# EAGLE schematic untitled (EAGLE 9.1.1)
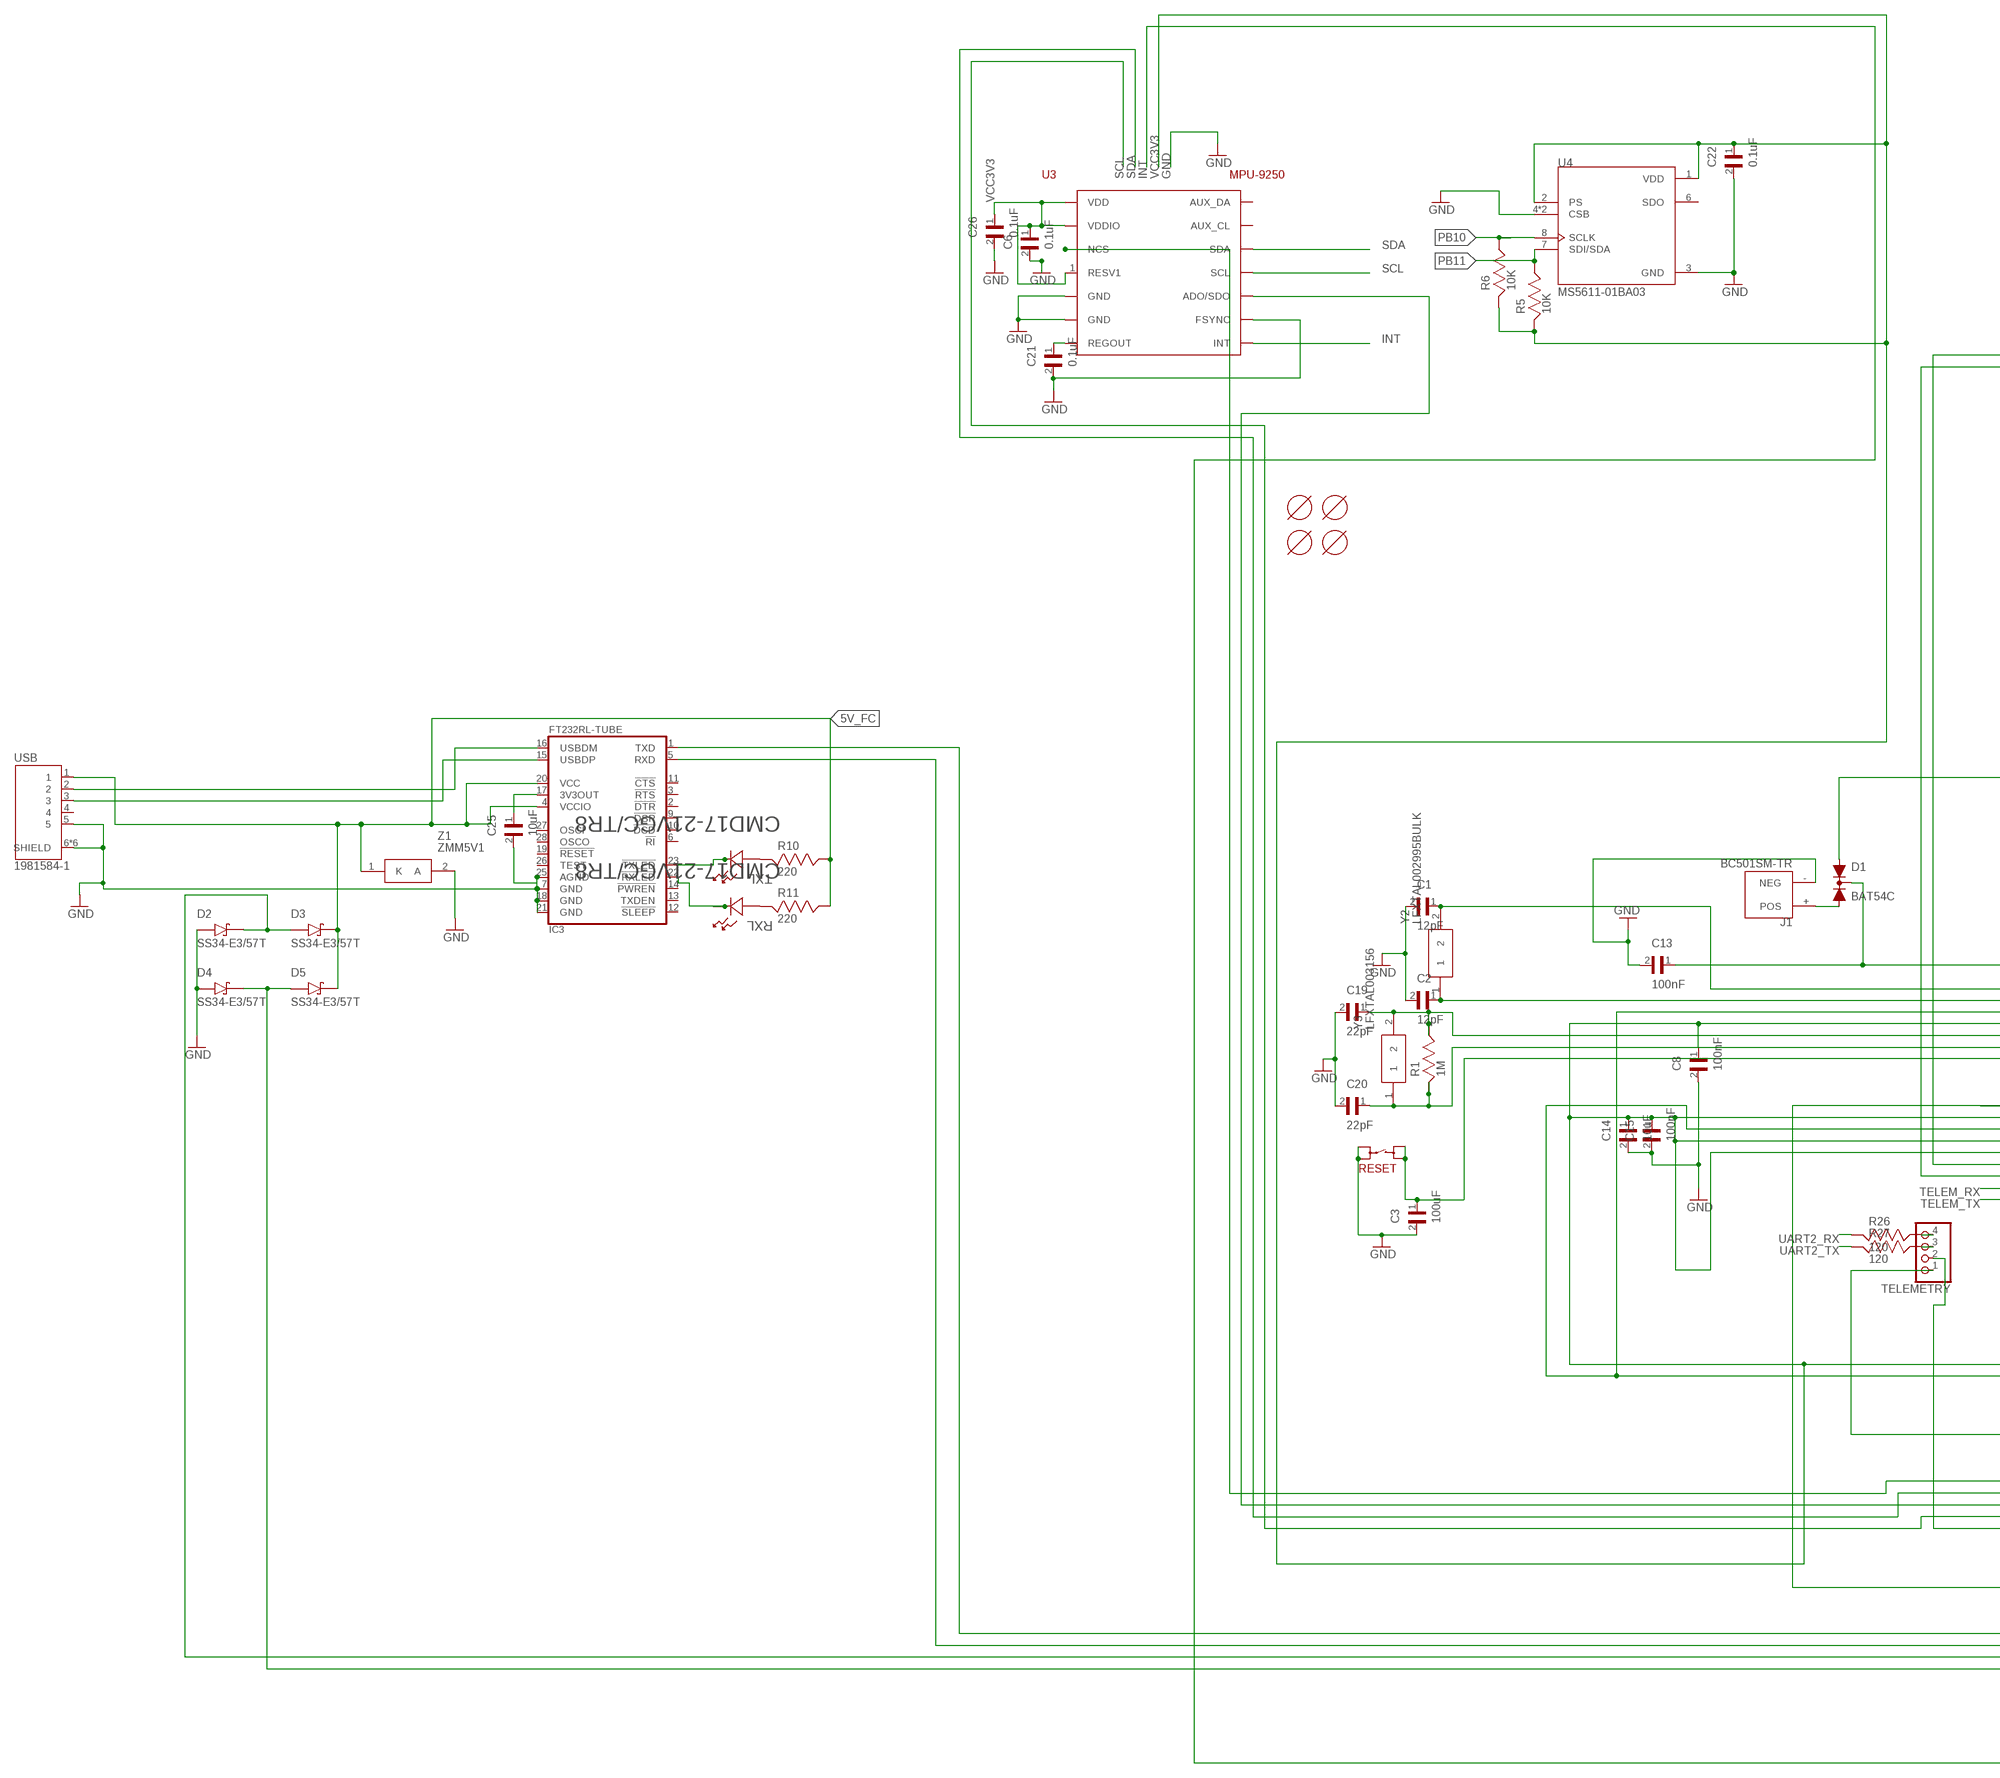
[diagram p0: schematic, sheet 1, part 1 of 2]
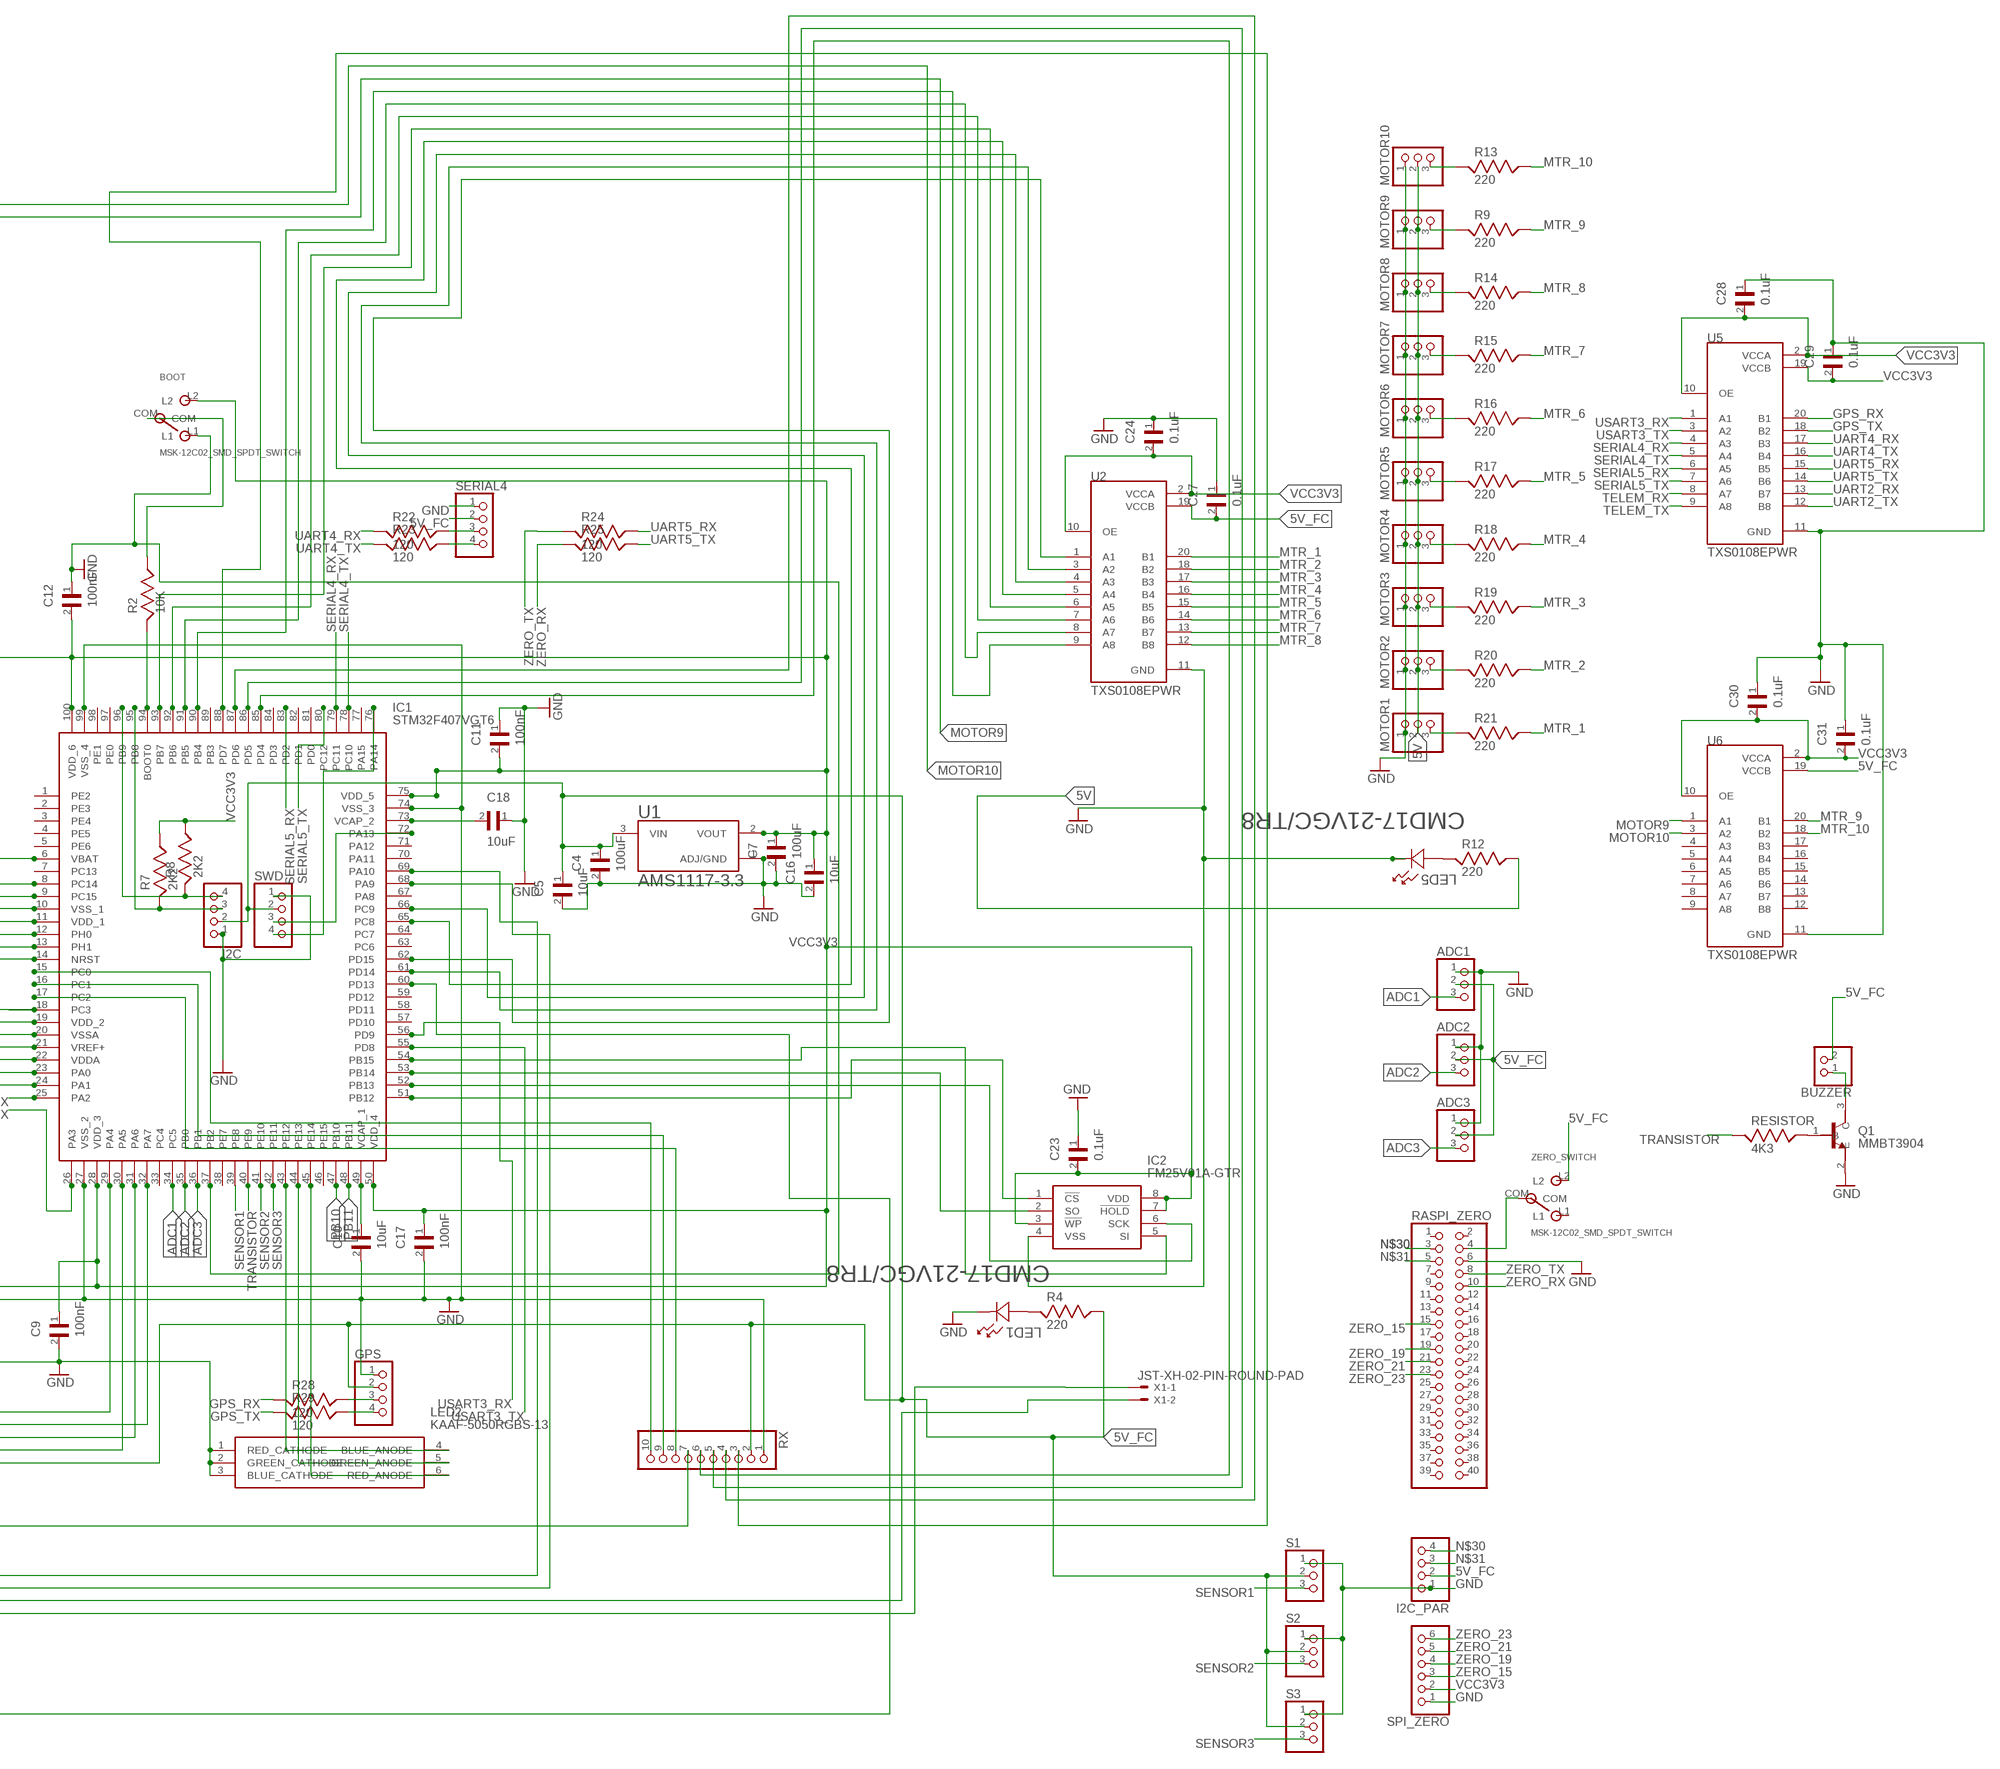
[diagram p1: schematic, sheet 1, part 2 of 2]

## Parts
ADC1  PINHD-1X3  [1X03]
ADC2  PINHD-1X3  [1X03]
ADC3  PINHD-1X3  [1X03]
BOOT  MSK-12C02_SMD_SPDT_SWITCH  [MSK-12C02]
BUZZER  PINHD-1X2  [1X02]
C1  12pF  08053C104KAT4A  [CAPC2012X94N]
C2  12pF  08053C104KAT4A  [CAPC2012X94N]
C3  100uF  08053C104KAT4A  [CAPC2012X94N]
C4  100uF  08053C104KAT4A  [CAPC2012X94N]
C5  10uF  08053C104KAT4A  [CAPC2012X94N]
C6  0.1uF  08053C104KAT4A  [CAPC2012X94N]
C7  100uF  08053C104KAT4A  [CAPC2012X94N]
C8  100nF  08053C104KAT4A  [CAPC2012X94N]
C9  100nF  08053C104KAT4A  [CAPC2012X94N]
C10  10uF  08053C104KAT4A  [CAPC2012X94N]
C11  100nF  08053C104KAT4A  [CAPC2012X94N]
C12  100nF  08053C104KAT4A  [CAPC2012X94N]
C13  100nF  08053C104KAT4A  [CAPC2012X94N]
C14  10uF  08053C104KAT4A  [CAPC2012X94N]
C15  100nF  08053C104KAT4A  [CAPC2012X94N]
C16  10uF  08053C104KAT4A  [CAPC2012X94N]
C17  100nF  08053C104KAT4A  [CAPC2012X94N]
C18  10uF  08053C104KAT4A  [CAPC2012X94N]
C19  22pF  08053C104KAT4A  [CAPC2012X94N]
C20  22pF  08053C104KAT4A  [CAPC2012X94N]
C21  0.1uF  08053C104KAT4A  [CAPC2012X94N]
C22  0.1uF  08053C104KAT4A  [CAPC2012X94N]
C23  0.1uF  08053C104KAT4A  [CAPC2012X94N]
C24  0.1uF  08053C104KAT4A  [CAPC2012X94N]
C25  10uF  08053C104KAT4A  [CAPC2012X94N]
C26  0.1uF  08053C104KAT4A  [CAPC2012X94N]
C27  0.1uF  08053C104KAT4A  [CAPC2012X94N]
C28  0.1uF  08053C104KAT4A  [CAPC2012X94N]
C29  0.1uF  08053C104KAT4A  [CAPC2012X94N]
C30  0.1uF  08053C104KAT4A  [CAPC2012X94N]
C31  0.1uF  08053C104KAT4A  [CAPC2012X94N]
D1  BAT54C  [SOT23-R]
D2  SS34-E3/57T  [DIOM7959X262N]
D3  SS34-E3/57T  [DIOM7959X262N]
D4  SS34-E3/57T  [DIOM7959X262N]
D5  SS34-E3/57T  [DIOM7959X262N]
GPS  PINHD-1X4  [1X04]
I2C  PINHD-1X4  [1X04]
I2C_PAR  PINHD-1X4  [1X04]
IC1  STM32F407VGT6  [QFP50P1600X1600X160-100N]
IC2  FM25V01A-GTR  [SOIC127P602X173-8N]
IC3  FT232RL-TUBE  [SSOP28-LD]
J1  BC501SM-TR  [MPD_BC501SM-TR]
LED1  CMD17-21VGC/TR8  [LED_CMD17-21VGC_TR8]
LED2  KAAF-5050RGBS-13  [KAAF-5050RGBS-13]
LED5  CMD17-21VGC/TR8  [LED_CMD17-21VGC_TR8]
M3_MOUNT1  MOUNT-HOLE3.1MM  [MOUNT-HOLE3.1]
M3_MOUNT1102  MOUNT-HOLE3.1MM  [MOUNT-HOLE3.1]
M3_MOUNT1103  MOUNT-HOLE3.1MM  [MOUNT-HOLE3.1]
M3_MOUNT1104  MOUNT-HOLE3.1MM  [MOUNT-HOLE3.1]
MOTOR1  PINHD-1X3  [1X03]
MOTOR2  PINHD-1X3  [1X03]
MOTOR3  PINHD-1X3  [1X03]
MOTOR4  PINHD-1X3  [1X03]
MOTOR5  PINHD-1X3  [1X03]
MOTOR6  PINHD-1X3  [1X03]
MOTOR7  PINHD-1X3  [1X03]
MOTOR8  PINHD-1X3  [1X03]
MOTOR9  PINHD-1X3  [1X03]
MOTOR10  PINHD-1X3  [1X03]
Q1  MMBT3904  [SOT95P240X120-3N]
R1  1M  RC0805FR-078M2L  [RESC2012X60]
R2  10K  RC0805FR-078M2L  [RESC2012X60]
R4  220  RC0805FR-078M2L  [RESC2012X60]
R5  10K  RC0805FR-078M2L  [RESC2012X60]
R6  10K  RC0805FR-078M2L  [RESC2012X60]
R7  2K2  RC0805FR-078M2L  [RESC2012X60]
R8  2K2  RC0805FR-078M2L  [RESC2012X60]
R9  220  RC0805FR-078M2L  [RESC2012X60]
R10  220  RC0805FR-078M2L  [RESC2012X60]
R11  220  RC0805FR-078M2L  [RESC2012X60]
R12  220  RC0805FR-078M2L  [RESC2012X60]
R13  220  RC0805FR-078M2L  [RESC2012X60]
R14  220  RC0805FR-078M2L  [RESC2012X60]
R15  220  RC0805FR-078M2L  [RESC2012X60]
R16  220  RC0805FR-078M2L  [RESC2012X60]
R17  220  RC0805FR-078M2L  [RESC2012X60]
R18  220  RC0805FR-078M2L  [RESC2012X60]
R19  220  RC0805FR-078M2L  [RESC2012X60]
R20  220  RC0805FR-078M2L  [RESC2012X60]
R21  220  RC0805FR-078M2L  [RESC2012X60]
R22  120  RC0805FR-078M2L  [RESC2012X60]
R23  120  RC0805FR-078M2L  [RESC2012X60]
R24  120  RC0805FR-078M2L  [RESC2012X60]
R25  120  RC0805FR-078M2L  [RESC2012X60]
R26  120  RC0805FR-078M2L  [RESC2012X60]
R27  120  RC0805FR-078M2L  [RESC2012X60]
R28  120  RC0805FR-078M2L  [RESC2012X60]
R29  120  RC0805FR-078M2L  [RESC2012X60]
RASPI_ZERO  PINHD-2X20  [2X20]
RESET  SKRPABE010  [SKRPABE010]
RESISTOR  4K3  RC0805FR-078M2L  [RESC2012X60]
RX  PINHD-1X10  [1X10]
RXL  CMD17-21VGC/TR8  [LED_CMD17-21VGC_TR8]
S1  PINHD-1X3  [1X03]
S2  PINHD-1X3  [1X03]
S3  PINHD-1X3  [1X03]
SERIAL4  PINHD-1X4  [1X04]
SPI_ZERO  PINHD-1X6  [1X06]
SWD  PINHD-1X4  [1X04]
TELEMETRY  PINHD-1X4  [1X04]
TXL  CMD17-21VGC/TR8  [LED_CMD17-21VGC_TR8]
U1  AMS1117-3.3  [SOT229P700X180-4N]
U2  TXS0108EPWR  [SOP65P640X120-20N]
U3  MPU-9250  [MPU-9250]
U4  MS5611-01BA03  [SON125P500X300X100-8N]
U5  TXS0108EPWR  [SOP65P640X120-20N]
U6  TXS0108EPWR  [SOP65P640X120-20N]
USB  1981584-1  [TE_1981584-1]
X1  JST-XH-02-PIN-ROUND-PAD  [JST-XH-02-PACKAGE-ROUND-PAD]
Y2  LFXTAL002995BULK  [LFXTAL002995BULK]
Y3  LFXTAL003156  [IQD-HC-49-4H]
Z1  ZMM5V1  [ZMM5V1]
ZERO_SWITCH  MSK-12C02_SMD_SPDT_SWITCH  [MSK-12C02]

## Nets
5V: MOTOR1.2 MOTOR2.2 MOTOR3.2 MOTOR4.2 MOTOR5.2 MOTOR6.2 MOTOR7.2 MOTOR8.2 MOTOR9.2 MOTOR10.2 R12.2
5V_FC: ADC1.2 ADC2.2 ADC3.2 BUZZER.2 C4.1 C5.1 C27.2 D3.C D5.C GPS.2 I2C.2 I2C_PAR.2 IC3.4(VCCIO) IC3.20(VCC) R4.2 R10.2 R11.2 RX.2 S1.2 S2.2 S3.2 SERIAL4.2 SWD.2 TELEMETRY.2 U1.3(VIN) U2.19(VCCB) U6.19(VCCB) USB.1 Z1.1(K) ZERO_SWITCH.L2
ADC1: ADC1.3 IC1.34(PC5)
ADC2: ADC2.3 IC1.35(PB0)
ADC3: ADC3.3 IC1.36(PB1)
GND: ADC1.1 ADC2.1 ADC3.1 BOOT.L1 C1.2 C2.2 C3.2 C4.2 C5.2 C6.2 C7.2 C8.2 C9.2 C10.2 C11.1 C12.1 C13.2 C14.2 C15.2 C16.2 C17.2 C18.1 C19.2 C20.2 C21.2 C22.2 C23.1 C24.1 C25.2 C26.2 C27.1 C28.1 C29.1 C30.1 C31.1 D2.A D4.A GPS.1 I2C.1 I2C_PAR.1 IC1.10(VSS_1) IC1.20(VSSA) IC1.27(VSS_2) IC1.37(PB2) IC1.74(VSS_3) IC1.99(VSS_4) IC2.4(VSS) IC3.7(GND) IC3.18(GND) IC3.21(GND) IC3.25(AGND) J1.-(NEG) LED1.2 LED2.1(RED_CATHODE) LED2.2(GREEN_CATHODE) LED2.3(BLUE_CATHODE) LED5.2 MOTOR1.1 MOTOR2.1 MOTOR3.1 MOTOR4.1 MOTOR5.1 MOTOR6.1 MOTOR7.1 MOTOR8.1 MOTOR9.1 MOTOR10.1 Q1.2(E) RASPI_ZERO.6 RESET.P$1 RESET.P$2 RX.1 S1.1 S2.1 S3.1 SERIAL4.1 SPI_ZERO.1 SWD.1 TELEMETRY.1 U1.1(ADJ/GND) U2.11(GND) U3.11(FSYNC) U3.18(GND) U3.20(GND) U4.3(GND) U4.4(CSB) U4.5(CSB) U5.11(GND) U6.11(GND) USB.5 USB.6(SHIELD) USB.7(SHIELD) USB.8(SHIELD) USB.9(SHIELD) USB.10(SHIELD) USB.11(SHIELD) Z1.2(A)
GND1: IC3.23(!TXLED) TXL.2
GND2: IC3.22(!RXLED) RXL.2
GPS_RX: R28.1 U5.20(B1)
GPS_TX: R29.1 U5.18(B2)
INT: IC1.60(PD13) U3.12(INT)
MOTOR9: IC1.24(PA1) U6.1(A1)
MOTOR10: IC1.23(PA0) U6.3(A2)
MTR_1: R21.2 U2.20(B1)
MTR_2: R20.2 U2.18(B2)
MTR_3: R19.2 U2.17(B3)
MTR_4: R18.2 U2.16(B4)
MTR_5: R17.2 U2.15(B5)
MTR_6: R16.2 U2.14(B6)
MTR_7: R15.2 U2.13(B7)
MTR_8: R14.2 U2.12(B8)
MTR_9: R9.2 U6.20(B1)
MTR_10: R13.2 U6.18(B2)
N$1: Q1.1(B) RESISTOR.2
N$2: IC1.72(PA13) SWD.3
N$3: C18.2 IC1.73(VCAP_2)
N$4: IC1.76(PA14) SWD.4
N$5: MOTOR10.3 R13.1
N$6: C3.1 IC1.14(NRST) RESET.P$3 RESET.P$4
N$7: IC1.69(PA10) IC3.1(TXD)
N$8: IC1.68(PA9) IC3.5(RXD)
N$9: IC1.94(BOOT0) R2.1
N$10: C21.1 U3.10(REGOUT)
N$11: BOOT.COM R2.2
N$12: BUZZER.1 Q1.3(C)
N$13: LED1.1 R4.1
N$14: IC1.62(PD15) U2.1(A1)
N$15: IC3.16(USBDM) USB.2
N$16: IC1.90(PB4) U2.9(A8)
N$17: IC3.15(USBDP) USB.3
N$18: IC1.92(PB6) U2.7(A6)
N$19: IC1.93(PB7) U2.6(A5)
N$20: MOTOR9.3 R9.1
N$21: IC1.65(PC8) U2.5(A4)
N$22: IC1.54(PB15) IC2.5(SI)
N$23: IC1.53(PB14) IC2.2(SO)
N$24: IC1.52(PB13) IC2.6(SCK)
N$25: IC1.51(PB12) IC2.1(!CS)
N$26: IC1.66(PC9) U2.4(A3)
N$27: IC1.61(PD14) U2.3(A2)
N$28: LED5.1 R12.1
N$29: IC1.45(PE14) LED2.6(RED_ANODE)
N$30: I2C.4 I2C_PAR.4 IC1.96(PB9) R8.1 RASPI_ZERO.3
N$31: I2C.3 I2C_PAR.3 IC1.95(PB8) R7.1 RASPI_ZERO.5
N$32: R26.2 TELEMETRY.4
N$33: C25.1 IC3.17(3V3OUT)
N$34: R10.1 TXL.1
N$35: IC1.91(PB5) U2.8(A7)
N$36: R11.1 RXL.1
N$37: IC1.44(PE13) LED2.5(GREEN_ANODE)
N$38: IC1.43(PE12) LED2.4(BLUE_ANODE)
N$39: IC1.85(PD4) RX.6
N$40: IC1.86(PD5) RX.5
N$41: IC1.87(PD6) RX.4
N$42: IC1.88(PD7) RX.3
N$43: C13.1 D1.3(C) IC1.6(VBAT)
N$44: R27.2 TELEMETRY.3
N$45: GPS.3 R28.2
N$46: GPS.4 R29.2
N$47: D1.2(A2) J1.+(POS)
N$48: RASPI_ZERO.4 ZERO_SWITCH.COM
N$49: D4.C D5.A X1.1
N$50: D2.C D3.A X1.2
N$52: MOTOR1.3 R21.1
N$53: MOTOR8.3 R14.1
N$54: MOTOR7.3 R15.1
N$55: MOTOR6.3 R16.1
N$56: MOTOR5.3 R17.1
N$57: MOTOR4.3 R18.1
N$58: IC1.18(PC3) RX.7
N$59: IC1.17(PC2) RX.8
N$60: IC1.16(PC1) RX.9
N$61: IC1.15(PC0) RX.10
N$62: MOTOR3.3 R19.1
N$63: C1.1 IC1.8(PC14) Y2.2
N$64: C2.1 IC1.9(PC15) Y2.1
N$65: MOTOR2.3 R20.1
N$76: C20.1 IC1.13(PH1) R1.1 Y3.1
N$77: C10.1 IC1.49(VCAP_1)
N$97: IC1.29(PA4) U3.22(NCS)
N$101: C19.1 IC1.12(PH0) R1.2 Y3.2
PB10: IC1.47(PB10) R6.2 U4.8(SCLK)
PB11: IC1.48(PB11) R5.2 U4.7(SDI/SDA)
PC10_TX: R23.2 SERIAL4.4
PC11_RX: R22.2 SERIAL4.3
SCL: IC1.30(PA5) U3.23(SCL)
SDA: IC1.32(PA7) U3.24(SDA)
SDO: IC1.31(PA6) U3.9(ADO/SDO)
SENSOR1: IC1.39(PE8) S1.3
SENSOR2: IC1.41(PE10) S2.3
SENSOR3: IC1.42(PE11) S3.3
SERIAL4_RX: IC1.79(PC11) U5.4(A3)
SERIAL4_TX: IC1.78(PC10) U5.5(A4)
SERIAL5_RX: IC1.83(PD2) U5.6(A5)
SERIAL5_TX: IC1.80(PC12) U5.7(A6)
TELEM_RX: IC1.25(PA2) U5.8(A7)
TELEM_TX: IC1.26(PA3) U5.9(A8)
TRANSISTOR: IC1.40(PE9) RESISTOR.1
UART2_RX: R26.1 U5.13(B7)
UART2_TX: R27.1 U5.12(B8)
UART4_RX: R22.1 U5.17(B3)
UART4_TX: R23.1 U5.16(B4)
UART5_RX: R24.2 U5.15(B5)
UART5_TX: R25.2 U5.14(B6)
USART3_RX: IC1.56(PD9) U5.1(A1)
USART3_TX: IC1.55(PD8) U5.3(A2)
VCC3V3: BOOT.L2 C6.1 C7.1 C8.1 C9.1 C11.2 C12.2 C14.1 C15.1 C16.1 C17.1 C22.1 C23.2 C24.2 C26.1 C28.2 C29.2 C30.2 C31.2 D1.1(A1) IC1.11(VDD_1) IC1.19(VDD_2) IC1.21(VREF+) IC1.22(VDDA) IC1.28(VDD_3) IC1.50(VDD_4) IC1.75(VDD_5) IC1.100(VDD_6) IC2.3(!WP) IC2.7(!HOLD) IC2.8(VDD) R5.1 R6.1 R7.2 R8.2 SPI_ZERO.2 U1.2(VOUT) U2.2(VCCA) U2.10(OE) U3.1(RESV1) U3.8(VDDIO) U3.13(VDD) U4.1(VDD) U4.2(PS) U5.2(VCCA) U5.10(OE) U5.19(VCCB) U6.2(VCCA) U6.10(OE)
ZERO_15: RASPI_ZERO.15 SPI_ZERO.3
ZERO_19: RASPI_ZERO.19 SPI_ZERO.4
ZERO_21: RASPI_ZERO.21 SPI_ZERO.5
ZERO_23: RASPI_ZERO.23 SPI_ZERO.6
ZERO_RX: R25.1 RASPI_ZERO.10
ZERO_TX: R24.1 RASPI_ZERO.8
Unconnected: IC1.1(PE2) IC1.2(PE3) IC1.3(PE4) IC1.4(PE5) IC1.5(PE6) IC1.7(PC13) IC1.33(PC4) IC1.38(PE7) IC1.46(PE15) IC1.57(PD10) IC1.58(PD11) IC1.59(PD12) IC1.63(PC6) IC1.64(PC7) IC1.67(PA8) IC1.70(PA11) IC1.71(PA12) IC1.77(PA15) IC1.81(PD0) IC1.82(PD1) IC1.84(PD3) IC1.89(PB3) IC1.97(PE0) IC1.98(PE1) IC3.2(!DTR) IC3.3(!RTS) IC3.6(!RI) IC3.9(!DSR) IC3.10(!DCD) IC3.11(!CTS) IC3.12(!SLEEP) IC3.13(TXDEN) IC3.14(!PWREN) IC3.19(!RESET) IC3.26(TEST) IC3.27(OSCI) IC3.28(OSCO) RASPI_ZERO.1 RASPI_ZERO.2 RASPI_ZERO.7 RASPI_ZERO.9 RASPI_ZERO.11 RASPI_ZERO.12 RASPI_ZERO.13 RASPI_ZERO.14 RASPI_ZERO.16 RASPI_ZERO.17 RASPI_ZERO.18 RASPI_ZERO.20 RASPI_ZERO.22 RASPI_ZERO.24 RASPI_ZERO.25 RASPI_ZERO.26 RASPI_ZERO.27 RASPI_ZERO.28 RASPI_ZERO.29 RASPI_ZERO.30 RASPI_ZERO.31 RASPI_ZERO.32 RASPI_ZERO.33 RASPI_ZERO.34 RASPI_ZERO.35 RASPI_ZERO.36 RASPI_ZERO.37 RASPI_ZERO.38 RASPI_ZERO.39 RASPI_ZERO.40 U3.7(AUX_CL) U3.21(AUX_DA) U4.6(SDO) U6.4(A3) U6.5(A4) U6.6(A5) U6.7(A6) U6.8(A7) U6.9(A8) U6.12(B8) U6.13(B7) U6.14(B6) U6.15(B5) U6.16(B4) U6.17(B3) USB.4 ZERO_SWITCH.L1

## Library data of the parts
ADC1-ADC3 MOTOR1-MOTOR10 S1-S3 = pinhead:PINHD-1X3: PIN HEADER
BOOT ZERO_SWITCH = MSK-12C02 SMD Micro Slider Switch SPDT:MSK-12C02_SMD_SPDT_SWITCH: Footprint of the VIMEX MSK-12C02 SPDT SMD Switch Created by mzst on 17-Jan-2016
BUZZER = pinhead:PINHD-1X2: PIN HEADER
C1-C31 = 08053C104KAT4A:08053C104KAT4A: 100NF 10% 25V 0805; AVAILABILITY: Unavailable; DESCRIPTION: 0805 100nF 25 V ±10 % Tolerance X7R SMT Multilayer Ceramic Capacitor; MF: AVX; MP: 08053C104KAT4A; PACKAGE: 0805 AVX; PRICE: None
D1 = BAT54C:BAT54C: BAT54C Schottky Diodes (Common Cathode) 30V 200mA, SOT-23 Package Digikey: BAT54CFSCT-ND; DESCRIPTION: Small Signal Schottky Diode, Dual Common Cathode, 30 V, 200 mA, 400 mV, 600 mA, 125 C; DIGI-KEY_PART_NUMBER: BAT54CFSCT-ND; DIGI-KEY_PURCHASE_URL: https://www.digikey.co.id/product-detail/en/on-semiconductor/BAT54C/BAT54CFSCT-ND/458929?utm_source=snapeda&utm_medium=aggregator&utm_campaign=symbol; MF: ON Semiconductor; MP: BAT54C; PACKAGE: SOT-23-3 ON Semiconductor
D2-D5 = SS34-E3_57T:SS34-E3/57T: Rectifier, Schottky; DO-214AB; 3.0A IF; 0.75V; 40V; 100A IFRM; 10000V/us; 1000pF; DESCRIPTION: Rectifier, Schottky; DO-214AB; 3.0A IF; 0.75V; 40V; 100A IFRM; 10000V/us; 1000pF; DIGI-KEY_PART_NUMBER: SS34-E3/57TGICT-ND; DIGI-KEY_PURCHASE_URL: https://www.digikey.co.id/product-detail/en/vishay-semiconductor-diodes-division/SS34-E3-57T/SS34-E3-57TGICT-ND/1091684?utm_source=snapeda&utm_medium=aggregator&utm_campaign=symbol; MF: Vishay; MP: SS34-E3/57T; PACKAGE: DO-214 Vishay
GPS I2C I2C_PAR SERIAL4 SWD TELEMETRY = pinhead:PINHD-1X4: PIN HEADER
IC1 = STM32F407VGT6:STM32F407VGT6: MCU 32-Bit, ARM Cortex M4, 1MB Flash STMicroelectronics STM32F407VGT6, 32bit ARM Cortex M4F Microcontroller, 168MHz, 1024 kB Flash, 100-Pin LQFP Source: Datasheet <https://www.arrow.com/en/products/stm32f407vgt6/stmicroelectronics>; ARROW_PART_NUMBER: STM32F407VGT6; DESCRIPTION: MCU 32-Bit, ARM Cortex M4, 1MB Flash STMicroelectronics STM32F407VGT6, 32bit ARM Cortex M4F Microcontroller, 168MHz, 1024 kB Flash, 100-Pin LQFP; HEIGHT: 1.6mm; MANUFACTURER_NAME: STMicroelectronics; MANUFACTURER_PART_NUMBER: STM32F407VGT6
IC2 = FM25V01A-GTR:FM25V01A-GTR: CYPRESS SEMICONDUCTOR - FM25V01A-GTR - F-RAM, NON-VOL, 128KBIT, 40MHZ, SOIC-8 Source: Datasheet <https://componentsearchengine.com/Datasheets/1/FM25V01A-GTR.pdf>; DESCRIPTION: CYPRESS SEMICONDUCTOR - FM25V01A-GTR - F-RAM, NON-VOL, 128KBIT, 40MHZ, SOIC-8; HEIGHT: 1.727mm; MANUFACTURER_NAME: Cypress Semiconductor; MANUFACTURER_PART_NUMBER: FM25V01A-GTR; MOUSER_PART_NUMBER: 727-FM25V01A-GTR; MOUSER_PRICE-STOCK: https://www.mouser.com/Search/Refine.aspx?Keyword=727-FM25V01A-GTR
IC3 = FT232RL-TUBE:FT232RL-TUBE; DESCRIPTION: USB-to-UART 1-CH 256byte FIFO 5V 28-Pin SSOP Tube; DIGI-KEY_PART_NUMBER: 768-1306-ND; DIGI-KEY_PURCHASE_URL: https://www.digikey.co.id/product-detail/en/ftdi-future-technology-devices-international-ltd/FT232RL-TUBE/768-1306-ND/4006920?utm_source=snapeda&utm_medium=aggregator&utm_campaign=symbol; MF: FTDI,; MP: FT232RL-TUBE; PACKAGE: SSOP-28 FTDI
J1 = BC501SM-TR:BC501SM-TR: Holder Coin Cell For Cr1220 Smd; AVAILABILITY: Unavailable; DESCRIPTION: Holder Coin Cell For Cr1220 Smd; MF: MPD _Memory; MP: BC501SM-TR; PACKAGE: DFN-8 MPD; PRICE: None
LED1 LED5 RXL TXL = CMD17-21VGC_TR8:CMD17-21VGC/TR8: LED, GREEN, 10MCD, 570NM; AVAILABILITY: Unavailable; DESCRIPTION: Led, Green, 1.25mm x 1.4mm, 10mcd, 570nm, Full Reel; MF: Visual; MP: CMD17-21VGC/TR8; PACKAGE: 0805 Chicago Miniature Lighting; PRICE: None
LED2 = KAAF-5050RGBS-13:KAAF-5050RGBS-13: RGB LED 5x5mm Kingbright KAAF-5050RGBS-13, KAAF Series 3 RGB LED, 470 / 525 / 625 nm 6-Pin, Round Lens SMD package Source: Datasheet <http://uk.rs-online.com/web/p/products/1654417>; DESCRIPTION: RGB LED 5x5mm Kingbright KAAF-5050RGBS-13, KAAF Series 3 RGB LED, 470 / 525 / 625 nm 6-Pin, Round Lens SMD package; HEIGHT: mm; MANUFACTURER_NAME: Kingbright; MANUFACTURER_PART_NUMBER: KAAF-5050RGBS-13; RS_PART_NUMBER: 1654417; RS_PRICE-STOCK: http://uk.rs-online.com/web/p/products/1654417
M3_MOUNT1 M3_MOUNT1102-M3_MOUNT1104 = pixhawk2:MOUNT-HOLE; BOM: EXCLUDE; PARTNO: *
Q1 = MMBT3904:MMBT3904: MMBT3904 Series 40 V CE Breakdown 0.2 A NPN General Purpose Amplifier - SOT-23; AVAILABILITY: Unavailable; DESCRIPTION: SOT-23, 60V, 0.2A, NPN Bipolar Transistor; MF: STMicroelectronics; MP: MMBT3904; PACKAGE: SOT-23-3 Taiwan Semiconductor; PRICE: None
R1 R2 R4-R29 RESISTOR = RC0805FR-078M2L:RC0805FR-078M2L: RC Series 0805 0.125 W 2 kOhms 5% ±100 ppm/°C SMT Thick Film Chip Resistor; AVAILABILITY: Unavailable; DESCRIPTION: Res Smd 8.2m Ohm 1% 1/8w 0805; MF: Yageo; MP: RC0805FR-078M2L; PACKAGE: 0805 Yageo; PRICE: None
RASPI_ZERO = pinhead:PINHD-2X20: PIN HEADER
RESET = Push Button:SKRPABE010: SKRPABE010 Alps Electronics SMD-mounted tactile switch; AVAILABILITY: Unavailable; DESCRIPTION: Switch Tactile N.O. SPST Button J-Bend 0.05A 16VDC 1.57N SMD Automotive T/R; MF: ALPS; MP: SKRPABE010; PACKAGE: None; PRICE: None
RX = pinhead:PINHD-1X10: PIN HEADER
SPI_ZERO = pinhead:PINHD-1X6: PIN HEADER
U1 = AMS1117-3.3:AMS1117-3.3: Sot223/Pkg 1-Amp 3.3-Volt Low Drop Out Voltage Regulatator; AVAILABILITY: Unavailable; DESCRIPTION: Sot223/Pkg 1-Amp 3.3-Volt Low Drop Out Voltage Regulatator; MF: Advanced Monolithic Systems; MP: AMS1117-3.3; PACKAGE: None; PRICE: None
U2 U5 U6 = TXS0108EPWR:TXS0108EPWR: 8-Bit Bidirectional Voltage-Level Translator For Open-Drain And Push-Pull Application 20-TSSOP -40 to 85; AVAILABILITY: Unavailable; DESCRIPTION: 8-Bit Bidirectional Voltage-Level Translator For Open-Drain And Push-Pull Application 20-TSSOP -40 to 85; MF: Texas Instruments; MP: TXS0108EPWR; PACKAGE: TSSOP-20 Texas Instruments; PRICE: None
U3 = SparkFun-Sensors:MPU-9250: The MPU-9250 is a 9-axis motion sensor that contains an accelerometer/gyro sensor (MPU-6500) combined with a magnetometer (AK8963).
U4 = MS5611-01BA03:MS5611-01BA03: Barometric Pressure Sensor, with stainless steel cap; AVAILABILITY: Unavailable; DESCRIPTION: Pressure Sensor 1.44V to 3.6V 0.01bar to 1.2bar Absolute 8-Pin SMT T/R; MF: TE Connectivity; MP: MS5611-01BA03; PACKAGE: SMD-8 TE Connectivity; PRICE: None
USB = Micro USB type B:1981584-1: CONN RCPT MICRO USB TYPE AB; AVAILABILITY: Unavailable; CENTERLINE_PITCH: .65 mm[.025 in]; COMMENT: 1981584-1; DESCRIPTION: REC TYPE AB ASSY _Au_ MICRO USB; MF: TE Connectivity; MP: 1981584-1; NUMBER_OF_POSITIONS: 5; PACKAGE: None; PRICE: None; PRODUCT_TYPE: Connector; TE_PURCHASE_URL: https://www.te.com/usa-en/product-1981584-1.html?te_bu=Cor&te_type=disp&te_campaign=seda_glo_cor-seda-global-disp-prtnr-fy19-seda-model-bom-cta_sma-317_1&elqCampaignId=32493
X1 = Rembrandt Electronics - JST XH Connectors v1-0:JST-XH-02-PIN: JST XH Connector 2 Pin Wire to board connector. Pitch: 2,54 mm, (0.100") Number of pins: 2 Created by Rembrandt Electronics www.rembrandtelectronics.com
Y2 = LFXTAL002995Bulk:LFXTAL002995BULK: Crystals 32.7680kHz 3.0 x 8.0mm Source: Datasheet <https://componentsearchengine.com/Datasheets/1/LFXTAL002995Bulk.pdf>; DESCRIPTION: Crystals 32.7680kHz 3.0 x 8.0mm; HEIGHT: mm; MANUFACTURER_NAME: IQD; MANUFACTURER_PART_NUMBER: LFXTAL002995Bulk; MOUSER_PART_NUMBER: 449-LFXTAL002995BULK
Y3 = LFXTAL003156:LFXTAL003156: Crystal,8.0000MHz,30ppm,30pF,HC49/4H,XTAL003156 8MHZ Source: Datasheet <http://uk.rs-online.com/web/p/products/1533666>; ALLIED_NUMBER: R1047051; DESCRIPTION: Crystal,8.0000MHz,30ppm,30pF,HC49/4H,XTAL003156 8MHZ; HEIGHT: mm; MANUFACTURER_NAME: IQD; MANUFACTURER_PART_NUMBER: LFXTAL003156; RS_PART_NUMBER: 1533666
Z1 = ZMM5V1:ZMM5V1: Silicon Epitaxial Planar Zener Diodes Source: Datasheet <http://files.rct.ru/pdf/diode/1021162227157.pdf>; DESCRIPTION: Silicon Epitaxial Planar Zener Diodes; HEIGHT: 1mm; MANUFACTURER_NAME: SEMTECH; MANUFACTURER_PART_NUMBER: ZMM5V1